# Altium schematic sheet VALVEBOARD_ValveInterface.SchDoc
size A4; SheetNumber: 7; SheetTotal: 9
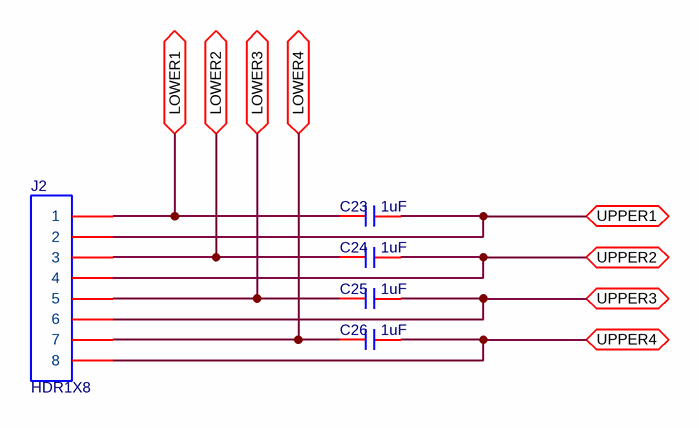
[diagram p0: VALVEBOARD_ValveInterface.SchDoc]

## Parts
C23  value 1uF  [C0805]  (hidden comment: C-NOMO)
C24  value 1uF  [C0805]  (hidden comment: C-NOMO)
C25  value 1uF  [C0805]  (hidden comment: C-NOMO)
C26  value 1uF  [C0805]  (hidden comment: C-NOMO)
J2  HDR1X8  [KF15EDGK-3.81-8P]

## Ports
LOWER1 (bidir), LOWER2 (bidir), LOWER3 (bidir), LOWER4 (bidir), UPPER1 (bidir), UPPER2 (bidir), UPPER3 (bidir), UPPER4 (bidir)

## Nets
LOWER1: C23.2 J2.1 ; port LOWER1
LOWER2: C24.2 J2.3 ; port LOWER2
LOWER3: C25.2 J2.5 ; port LOWER3
LOWER4: C26.2 J2.7 ; port LOWER4
UPPER1: C23.1 J2.2 ; port UPPER1
UPPER2: C24.1 J2.4 ; port UPPER2
UPPER3: C25.1 J2.6 ; port UPPER3
UPPER4: C26.1 J2.8 ; port UPPER4

## Library data of the parts
C23-C26 = C-NOMO: voltage: 25V; precision: 5%